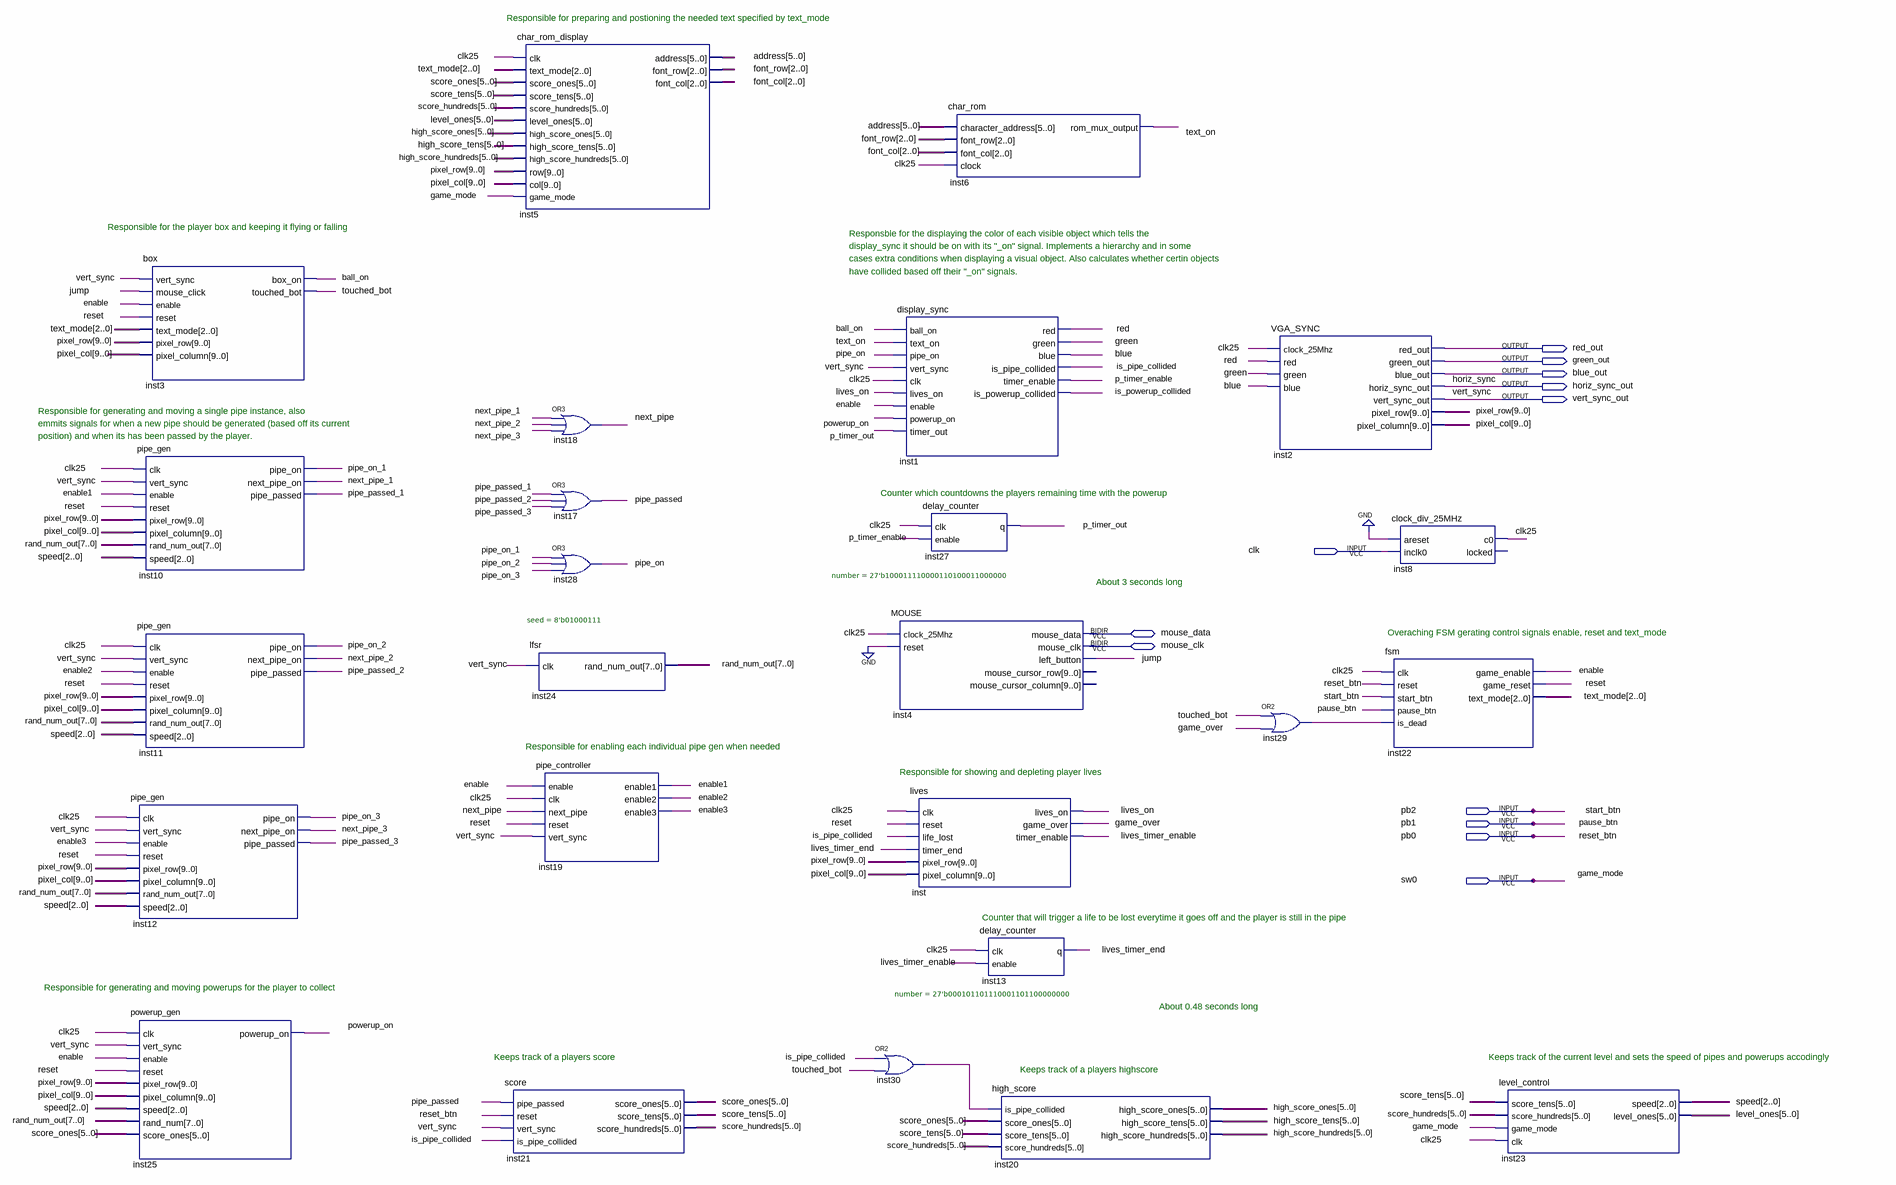
[diagram p0: schematic sheet]
// Quartus schematic Flappy_Bird.bdf as structural Verilog: 25 symbols, 12 pins
module Flappy_Bird (
  input  clk,
  input  pb2,
  input  pb1,
  input  pb0,
  input  sw0,
  inout  mouse_data,
  inout  mouse_clk,
  output red_out,
  output green_out,
  output blue_out,
  output horiz_sync_out,
  output vert_sync_out
);

  wire ball_on, blue, clk25, enable, enable1, enable2, enable3, game_over, green, inst29_out, inst30_out,
       is_pipe_collided, is_powerup_collided, jump, lives_on, lives_timer_enable, lives_timer_end, next_pipe,
       next_pipe_1, next_pipe_2, next_pipe_3, p_timer_enable, p_timer_out, pipe_on, pipe_on_1, pipe_on_2,
       pipe_on_3, pipe_passed, pipe_passed_1, pipe_passed_2, pipe_passed_3, powerup_on, red, reset, text_on,
       touched_bot;
  wire [2:0] font_col, font_row, speed, text_mode;
  wire [5:0] address, high_score_hundreds, high_score_ones, high_score_tens, level_ones, score_hundreds,
       score_ones, score_tens;
  wire [7:0] rand_num_out;
  wire [9:0] pixel_col, pixel_row;

  box inst3 (
    .vert_sync(vert_sync_out), .mouse_click(jump), .enable(enable), .reset(reset), .text_mode(text_mode),
    .pixel_row(pixel_row), .pixel_column(pixel_col), .box_on(ball_on), .touched_bot(touched_bot));
  pipe_gen inst10 (
    .clk(clk25), .vert_sync(vert_sync_out), .enable(enable1), .reset(reset), .pixel_row(pixel_row),
    .pixel_column(pixel_col), .rand_num_out(rand_num_out), .speed(speed), .pipe_on(pipe_on_1),
    .next_pipe_on(next_pipe_1), .pipe_passed(pipe_passed_1));
  pipe_gen inst11 (
    .clk(clk25), .vert_sync(vert_sync_out), .enable(enable2), .reset(reset), .pixel_row(pixel_row),
    .pixel_column(pixel_col), .rand_num_out(rand_num_out), .speed(speed), .pipe_on(pipe_on_2),
    .next_pipe_on(next_pipe_2), .pipe_passed(pipe_passed_2));
  pipe_gen inst12 (
    .clk(clk25), .vert_sync(vert_sync_out), .enable(enable3), .reset(reset), .pixel_row(pixel_row),
    .pixel_column(pixel_col), .rand_num_out(rand_num_out), .speed(speed), .pipe_on(pipe_on_3),
    .next_pipe_on(next_pipe_3), .pipe_passed(pipe_passed_3));
  powerup_gen inst25 (
    .clk(clk25), .vert_sync(vert_sync_out), .enable(enable), .reset(reset), .pixel_row(pixel_row),
    .pixel_column(pixel_col), .speed(speed), .rand_num(rand_num_out), .score_ones(score_ones),
    .powerup_on(powerup_on));
  char_rom_display inst5 (
    .clk(clk25), .text_mode(text_mode), .score_ones(score_ones), .score_tens(score_tens),
    .score_hundreds(score_hundreds), .level_ones(level_ones), .high_score_ones(high_score_ones),
    .high_score_tens(high_score_tens), .high_score_hundreds(high_score_hundreds), .row(pixel_row),
    .col(pixel_col), .game_mode(sw0), .address(address), .font_row(font_row), .font_col(font_col));
  lfsr #(.seed(8'b01000111)) inst24 (.clk(vert_sync_out), .rand_num_out(rand_num_out));
  pipe_controller inst19 (
    .enable(enable), .clk(clk25), .next_pipe(next_pipe), .reset(reset), .vert_sync(vert_sync_out),
    .enable1(enable1), .enable2(enable2), .enable3(enable3));
  score inst21 (
    .pipe_passed(pipe_passed), .reset(pb0), .vert_sync(vert_sync_out), .is_pipe_collided(is_pipe_collided),
    .score_ones(score_ones), .score_tens(score_tens), .score_hundreds(score_hundreds));
  or inst18 (next_pipe, next_pipe_1, next_pipe_2, next_pipe_3);
  or inst17 (pipe_passed, pipe_passed_1, pipe_passed_2, pipe_passed_3);
  or inst28 (pipe_on, pipe_on_1, pipe_on_2, pipe_on_3);
  display_sync inst1 (
    .ball_on(ball_on), .text_on(text_on), .pipe_on(pipe_on), .vert_sync(vert_sync_out), .clk(clk25),
    .lives_on(lives_on), .enable(enable), .powerup_on(powerup_on), .timer_out(p_timer_out), .red(red),
    .green(green), .blue(blue), .is_pipe_collided(is_pipe_collided), .timer_enable(p_timer_enable),
    .is_powerup_collided(is_powerup_collided));
  MOUSE inst4 (
    .clock_25Mhz(clk25), .reset(1'b0), .left_button(jump), .mouse_data(mouse_data), .mouse_clk(mouse_clk));  // open: mouse_cursor_row, mouse_cursor_column
  or inst30 (inst30_out, is_pipe_collided, touched_bot);
  char_rom inst6 (
    .character_address(address), .font_row(font_row), .font_col(font_col), .clock(clk25),
    .rom_mux_output(text_on));
  delay_counter #(.number(27'b100011110000110100011000000)) inst27 (
    .clk(clk25), .enable(p_timer_enable), .q(p_timer_out));
  lives inst (
    .clk(clk25), .reset(reset), .life_lost(is_pipe_collided), .timer_end(lives_timer_end),
    .pixel_row(pixel_row), .pixel_column(pixel_col), .lives_on(lives_on), .game_over(game_over),
    .timer_enable(lives_timer_enable));
  delay_counter #(.number(27'b000101101110001101100000000)) inst13 (
    .clk(clk25), .enable(lives_timer_enable), .q(lives_timer_end));
  high_score inst20 (
    .is_pipe_collided(inst30_out), .score_ones(score_ones), .score_tens(score_tens),
    .score_hundreds(score_hundreds), .high_score_ones(high_score_ones), .high_score_tens(high_score_tens),
    .high_score_hundreds(high_score_hundreds));
  VGA_SYNC inst2 (
    .clock_25Mhz(clk25), .red(red), .green(green), .blue(blue), .red_out(red_out), .green_out(green_out),
    .blue_out(blue_out), .horiz_sync_out(horiz_sync_out), .vert_sync_out(vert_sync_out),
    .pixel_row(pixel_row), .pixel_column(pixel_col));
  or inst29 (inst29_out, touched_bot, game_over);
  clock_div_25MHz inst8 (.areset(1'b0), .inclk0(clk), .c0(clk25));  // open: locked
  fsm inst22 (
    .clk(clk25), .reset(pb0), .start_btn(pb2), .pause_btn(pb1), .is_dead(inst29_out), .game_enable(enable),
    .game_reset(reset), .text_mode(text_mode));
  level_control inst23 (
    .score_tens(score_tens), .score_hundreds(score_hundreds), .game_mode(sw0), .clk(clk25), .speed(speed),
    .level_ones(level_ones));

  // Other names for the same wires on the sheet: horiz_sync = horiz_sync_out; reset_btn = pb0; pause_btn = pb1;
  //   start_btn = pb2; game_mode = sw0; vert_sync = vert_sync_out

  // Notes on the sheet:
  //   Responsible for preparing and postioning the needed text specified by text_mode 
  //   Responsible for the player box and keeping it flying or falling  
  //   Responsble for the displaying the color of each visible object which tells the  
  //   display_sync it should be on with its "_on" signal. Implements a hierarchy and in some 
  //   cases extra conditions when displaying a visual object. Also calculates whether certin objects
  //   have collided based off their "_on" signals.
  //   Responsible for generating and moving a single pipe instance, also 
  //   emmits signals for when a new pipe should be generated (based off its current 
  //   position) and when its has been passed by the player.
  //   Counter which countdowns the players remaining time with the powerup
  //   About 3 seconds long
  //   Overaching FSM gerating control signals enable, reset and text_mode
  //   Responsible for enabling each individual pipe gen when needed
  //   Responsible for showing and depleting player lives
  //   Counter that will trigger a life to be lost everytime it goes off and the player is still in the pipe
  //   Responsible for generating and moving powerups for the player to collect
  //   About 0.48 seconds long
  //   Keeps track of a players score 
  //   Keeps track of the current level and sets the speed of pipes and powerups accodingly 
  //   Keeps track of a players highscore 
endmodule
